# EAGLE design UV - SERVO_CTRL (EAGLE 6.3)
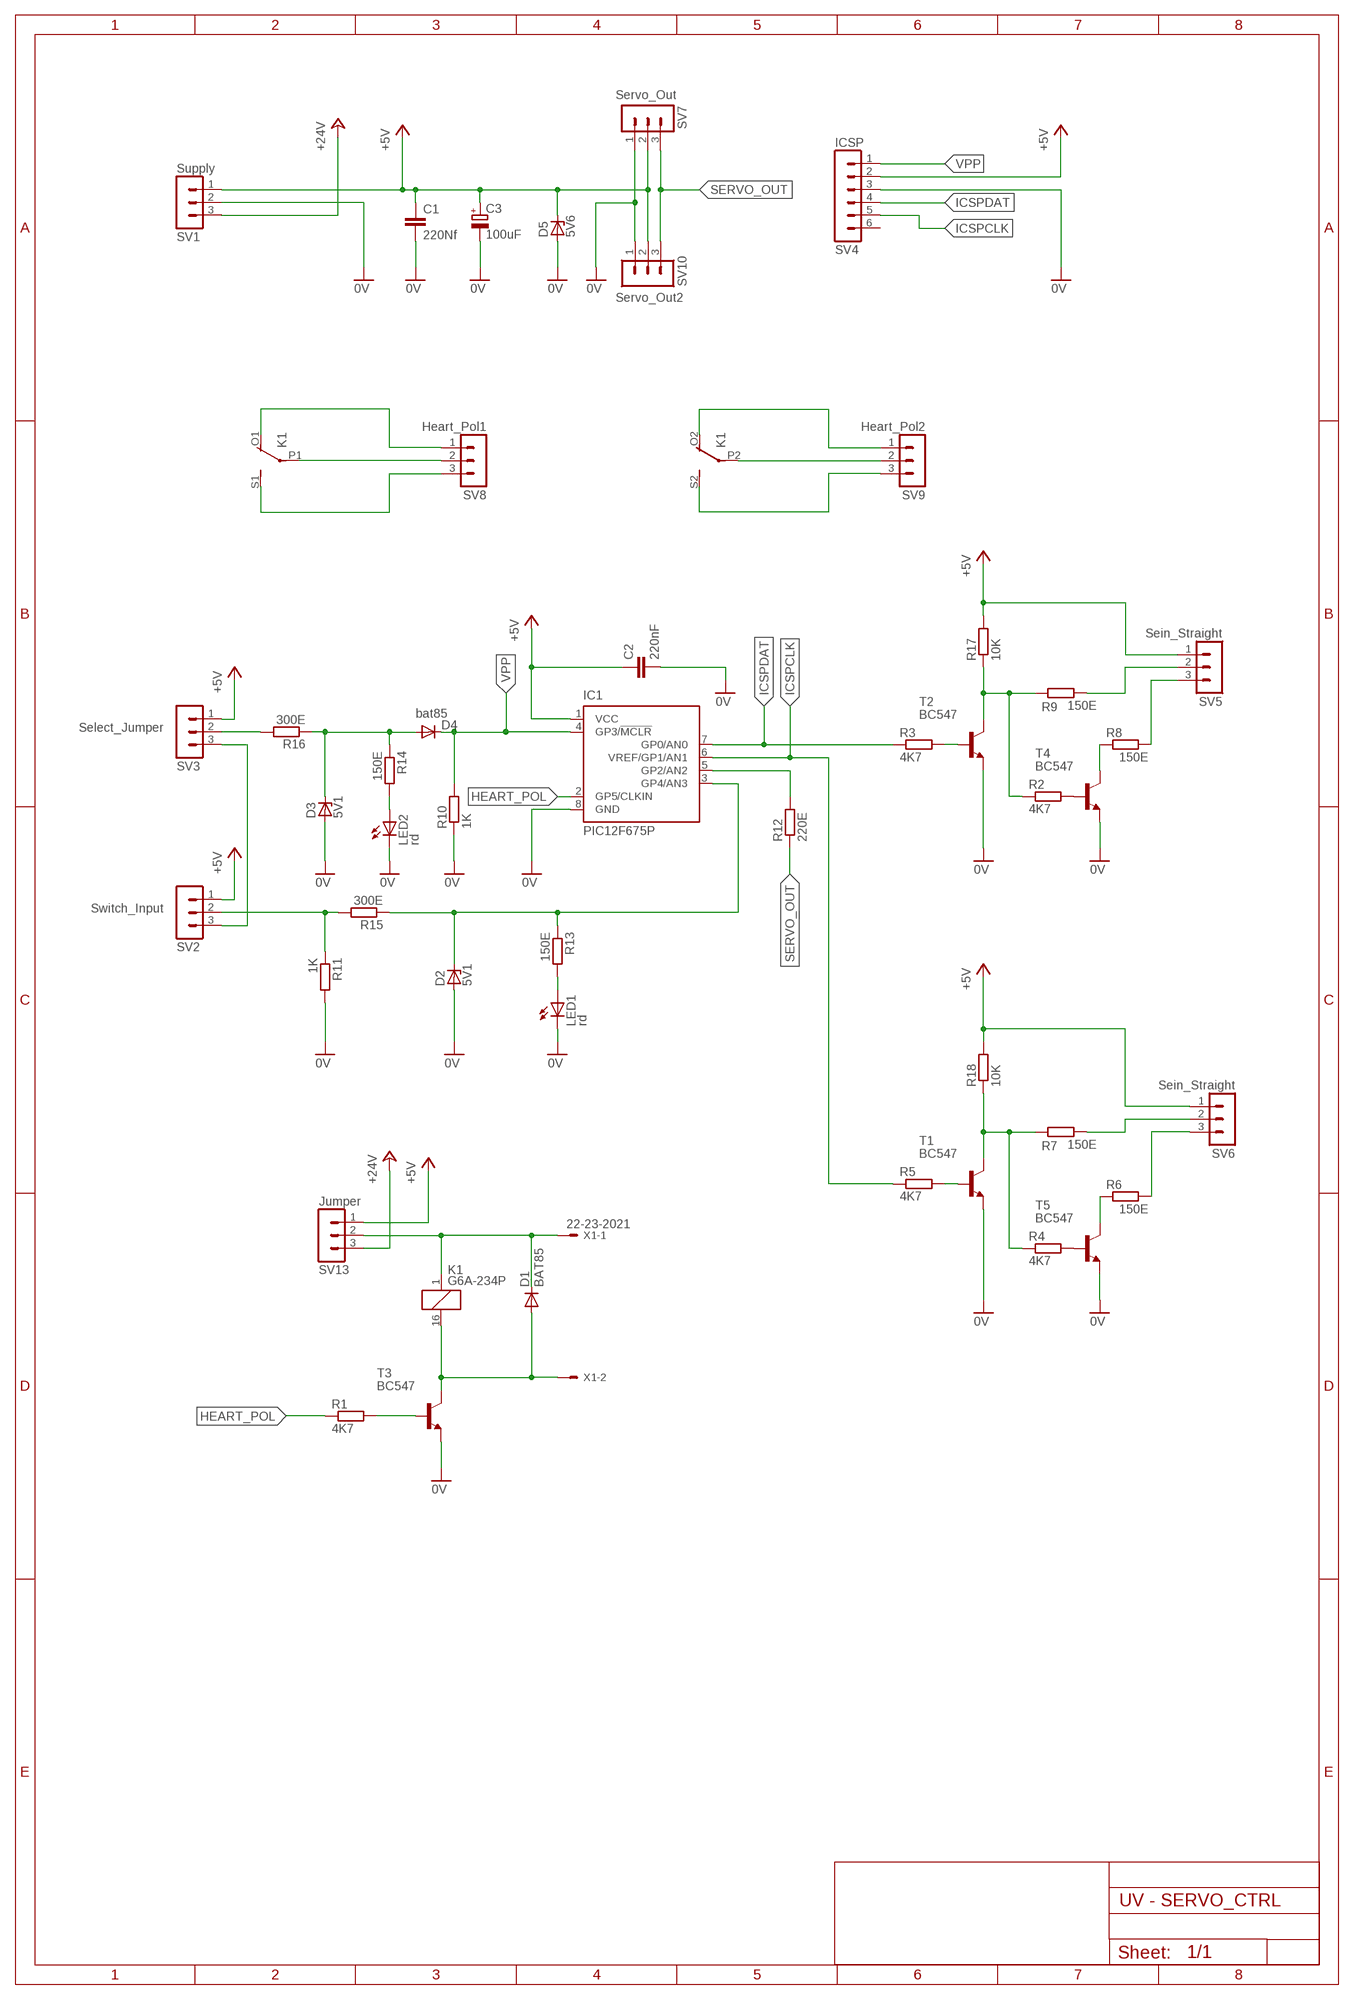
[diagram p0: schematic, sheet 1]

## Parts
C1  220Nf  C-EU050-025X075  [C050-025X075]
C2  220nF  C-EU050-025X075  [C050-025X075]
C3  100uF  CPOL-EUE2.5-7  [E2,5-7]
D1  BAT85  BAT81  [DO34-7]
D2  5V1  ZENER-DIODEDO34-7  [DO34Z7]
D3  5V1  ZENER-DIODEDO34-7  [DO34Z7]
D4  bat85  BAT81  [DO34-7]
D5  5V6  1N5333  [C1702-15]
IC1  PIC12F675P  [DIL8]
K1  G6A-234P  [G6A-234P]
LED1  rd  LED3MM  [LED3MM]
LED2  rd  LED3MM  [LED3MM]
R1  4K7  R-EU_0207/2V  [0207/2V]
R2  4K7  R-EU_0207/2V  [0207/2V]
R3  4K7  R-EU_0207/2V  [0207/2V]
R4  4K7  R-EU_0207/2V  [0207/2V]
R5  4K7  R-EU_0207/2V  [0207/2V]
R6  150E  R-EU_0207/2V  [0207/2V]
R7  150E  R-EU_0207/2V  [0207/2V]
R8  150E  R-EU_0207/2V  [0207/2V]
R9  150E  R-EU_0207/2V  [0207/2V]
R10  1K  R-EU_0207/2V  [0207/2V]
R11  1K  R-EU_0207/2V  [0207/2V]
R12  220E  R-EU_0207/2V  [0207/2V]
R13  150E  R-EU_0207/2V  [0207/2V]
R14  150E  R-EU_0207/2V  [0207/2V]
R15  300E  R-EU_0207/2V  [0207/2V]
R16  300E  R-EU_0207/2V  [0207/2V]
R17  10K  R-EU_0207/2V  [0207/2V]
R18  10K  R-EU_0207/2V  [0207/2V]
SV1  Supply  MA03-1  [MA03-1]
SV2  Switch_Input  MA03-1  [MA03-1]
SV3  Select_Jumper  MA03-1  [MA03-1]
SV4  ICSP  MA06-1  [MA06-1]
SV5  Sein_Straight  MA03-1  [MA03-1]
SV6  Sein_Straight  MA03-1  [MA03-1]
SV7  Servo_Out  MA03-1  [MA03-1]
SV8  Heart_Pol1  MA03-1  [MA03-1]
SV9  Heart_Pol2  MA03-1  [MA03-1]
SV10  Servo_Out2  MA03-1  [MA03-1]
SV13  Jumper  MA03-1  [MA03-1]
T1  BC547  [TO92]
T2  BC547  [TO92]
T3  BC547  [TO92]
T4  BC547  [TO92]
T5  BC547  [TO92]
X1  22-23-2021  [22-23-2021]

## Nets
0V: C1.2 C2.2 C3.- D2.A D3.A D5.A IC1.8(GND) LED1.K(C) LED2.K(C) R10.1 R11.2 SV1.2 SV4.3 SV7.1 SV10.1 T1.1(E) T2.1(E) T3.1(E) T4.1(E) T5.1(E)
+5V: C1.1 C2.1 C3.+ D5.C IC1.1(VCC) R17.2 R18.2 SV1.1 SV2.1 SV3.1 SV4.2 SV5.1 SV6.1 SV7.2 SV10.2 SV13.1
+24V: SV1.3 SV13.3
HEART_POL: IC1.2(GP5/CLKIN) R1.1
ICSPCLK: IC1.6(VREF/GP1/AN1) R5.1 SV4.5
ICSPDAT: IC1.7(GP0/AN0) R3.1 SV4.4
N$1: D2.C IC1.3(GP4/AN3) R13.1 R15.1
N$2: K1.O1(2:O) SV8.1
N$3: SV2.3 SV3.3
N$4: K1.S1(2:S) SV8.3
N$5: K1.P1(2:P) SV8.2
N$6: K1.O2(3:O) SV9.1
N$7: K1.S2(3:S) SV9.3
N$8: K1.P2(3:P) SV9.2
N$9: IC1.5(GP2/AN2) R12.2
N$10: R1.2 T3.2(B)
N$11: D1.C K1.1 SV13.2 X1.1
N$12: D1.A K1.16 T3.3(C) X1.2
N$13: R4.2 T5.2(B)
N$14: R6.1 T5.3(C)
N$15: R6.2 SV6.3
N$16: R5.2 T1.2(B)
N$17: R11.1 R15.2 SV2.2
N$18: R4.1 R7.1 R18.1 T1.3(C)
N$19: R7.2 SV6.2
N$20: R2.2 T4.2(B)
N$21: R8.1 T4.3(C)
N$22: R8.2 SV5.3
N$23: R9.2 SV5.2
N$24: R2.1 R9.1 R17.1 T2.3(C)
N$25: R3.2 T2.2(B)
N$26: D3.C D4.A R14.1 R16.1
N$27: LED2.A R14.2
N$28: LED1.A R13.2
N$29: R16.2 SV3.2
SERVO_OUT: R12.1 SV7.3 SV10.3
VPP: D4.C IC1.4(GP3/!MCLR) R10.2 SV4.1
Unconnected: SV4.6

## Library data of the parts
C1 C2 = rcl:C-EU: CAPACITOR, European symbol; MPN: MCPBSFC-1J222KA45; OC_NEWARK: 49P5385
C3 = rcl:CPOL-EU: POLARIZED CAPACITOR, European symbol; MF: ILLINOIS CAPACITOR,INC.; MPN: 107CKE035M; OC_NEWARK: 69K7903
D1 D4 = diode:BAT81: DIODE barrier diode; MPN: BAT85,113; OC_NEWARK: 75R0671
D2 D3 = diode:ZENER-DIODE: Z-Diode; MPN: BZX55C5V1-TAP; OC_NEWARK: 55R1524
D5 = diode:1N5333: Z DIODE 3.3 V, 5W, 5 percent (Motorola); MF: FAIRCHILD SEMICONDUCTOR; MPN: BZX85C5V1; OC_NEWARK: 18C6038
IC1 = microchip:PIC12F675: 8-Pin FLASH-Based 8-Bit CMOS Microcontroller Precision Internal 4 MHz oscillator factory calibrated to ±1% Low Power Features: Standby Current: - 1 nA @ 2.0V, typical Operating Current: - 8.5µA @ 32 kHz, 2.0V, typical - 100µA @ 1 MHz, 2.0V, typical Watchdog Timer Current: - 300 nA @ 2.0V, typical Timer1 oscillator current: - 4µA @ 32 kHz, 2.0V, typical Analog-to-Digital Converter module: - 10-bit resolution - Programmable 4-channel input - Voltage reference input Source: http://www.microchip.com .. 41190E.pdf; MF: MICROCHIP; MPN: PIC12F675-E/P; OC_FARNELL: 9759018; OC_NEWARK: 92C4340
K1 = relay:G6A-234P: RELAY 2 x switch, 0.3 A/125 V AC, 1 A/30 V DC, Omron; MF: OMRON COMPONENTS USA; MPN: G6A-234P-ST40-US-DC12; OC_FARNELL: unknown; OC_NEWARK: 89C6109
LED1 LED2 = led:LED: LED OSRAM: - CHIPLED LG R971, LG N971, LY N971, LG Q971, LY Q971, LO R971, LY R971 LH N974, LH R974 LS Q976, LO Q976, LY Q976 LO Q996 - Hyper CHIPLED LW Q18S LB Q993, LB Q99A, LB R99A - SideLED LS A670, LO A670, LY A670, LG A670, LP A670 LB A673, LV A673, LT A673, LW A673 LH A674 LY A675 LS A676, LA A676, LO A676, LY A676, LW A676 LS A679, LY A679, LG A679 - Hyper Micro SIDELED® LS Y876, LA Y876, LO Y876, LY Y876 LT Y87S - SmartLED LW L88C, LW L88S LB L89C, LB L89S, LG L890 LS L89K, LO L89K, LY L89K LS L896, LA L896, LO L896, LY L896 - TOPLED LS T670, LO T670, LY T670, LG T670, LP T670 LSG T670, LSP T670, LSY T670, LOP T670, LYG T670 LG T671, LOG T671, LSG T671 LB T673, LV T673, LT T673, LW T673 LH T674 LS T676, LA T676, LO T676, LY T676, LB T676, LH T676, LSB T676, LW T676 LB T67C, LV T67C, LT T67C, LS T67K, LO T67K, LY T67K, LW E67C LS E67B, LA E67B, LO E67B, LY E67B, LB E67C, LV E67C, LT E67C LW T67C LS T679, LY T679, LG T679 LS T770, LO T770, LY T770, LG T770, LP T770 LB T773, LV T773, LT T773, LW T773 LH T774 LS E675, LA E675, LY E675, LS T675 LS T776, LA T776, LO T776, LY T776, LB T776 LHGB T686 LT T68C, LB T68C - Hyper Mini TOPLED® LB M676 - Mini TOPLED Santana® LG M470 LS M47K, LO M47K, LY M47K Source: http://www.osram.convergy.de LUXEON: - LUMILED® LXK2-PW12-R00, LXK2-PW12-S00, LXK2-PW14-U00, LXK2-PW14-V00 LXK2-PM12-R00, LXK2-PM12-S00, LXK2-PM14-U00 LXK2-PE12-Q00, LXK2-PE12-R00, LXK2-PE12-S00, LXK2-PE14-T00, LXK2-PE14-U00 LXK2-PB12-K00, LXK2-PB12-L00, LXK2-PB12-M00, LXK2-PB14-N00, LXK2-PB14-P00, LXK2-PB14-Q00 LXK2-PR12-L00, LXK2-PR12-M00, LXK2-PR14-Q00, LXK2-PR14-R00 LXK2-PD12-Q00, LXK2-PD12-R00, LXK2-PD12-S00 LXK2-PH12-R00, LXK2-PH12-S00 LXK2-PL12-P00, LXK2-PL12-Q00, LXK2-PL12-R00 Source: www.luxeon.com KINGBRIGHT: KA-3528ASYC Source: www.kingbright.com; MPN: L-934ND; OC_NEWARK: 26M0081
R1-R5 = rcl:R-EU_: RESISTOR, European symbol; MF: FARNELL; MPN: MCF 0.25W 4K7; OC_NEWARK: 38K0376
R6-R9 R13 R14 = rcl:R-EU_: RESISTOR, European symbol; MF: FARNELL; MPN: MCF 0.25W 150R; OC_NEWARK: 38K0339
R10 R11 = rcl:R-EU_: RESISTOR, European symbol; MF: FARNELL; MPN: MCF 0.25W 1K; OC_NEWARK: 38K0327
R12 = rcl:R-EU_: RESISTOR, European symbol; MF: FARNELL; MPN: MCF 0.25W 220R; OC_NEWARK: 38K0351
R15 R16 = rcl:R-EU_: RESISTOR, European symbol; MF: FARNELL; MPN: MF25 300R; OC_NEWARK: 38K5327
R17 R18 = rcl:R-EU_: RESISTOR, European symbol; MF: FARNELL; MPN: MCF 0.25W 10K; OC_NEWARK: 38K0328
SV1-SV3 SV5-SV10 SV13 = con-lstb:MA03-1: PIN HEADER; MPN: 90120-0761; OC_FARNELL: unknown; OC_NEWARK: 34R6158
SV4 = con-lstb:MA06-1: PIN HEADER; MPN: 90120-0761; OC_FARNELL: unknown; OC_NEWARK: 34R6158
T1-T5 = transistor:BC547: NPN TRANSISTOR; MPN: BC547B; OC_NEWARK: 08N8056
X1 = con-molex:22-23-2021: .100" (2.54mm) Center Header - 2 Pin; MF: MOLEX; MPN: 22-23-2021; OC_FARNELL: 1462926; OC_NEWARK: 25C3832

## Board
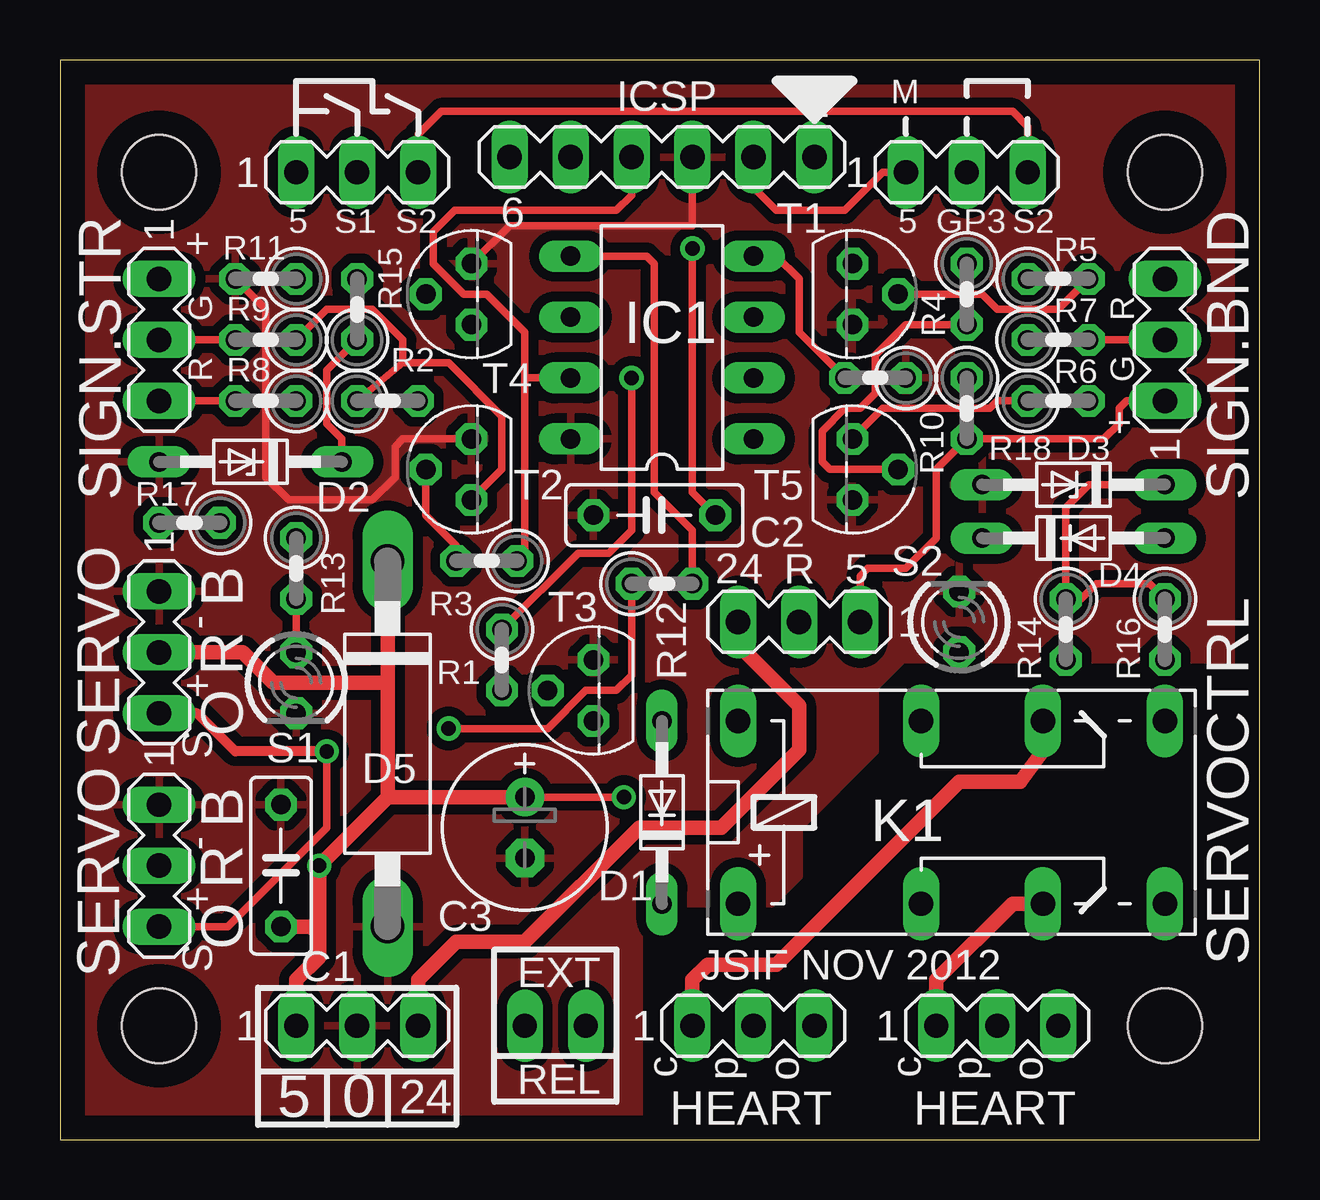
[diagram p1: board, top side]
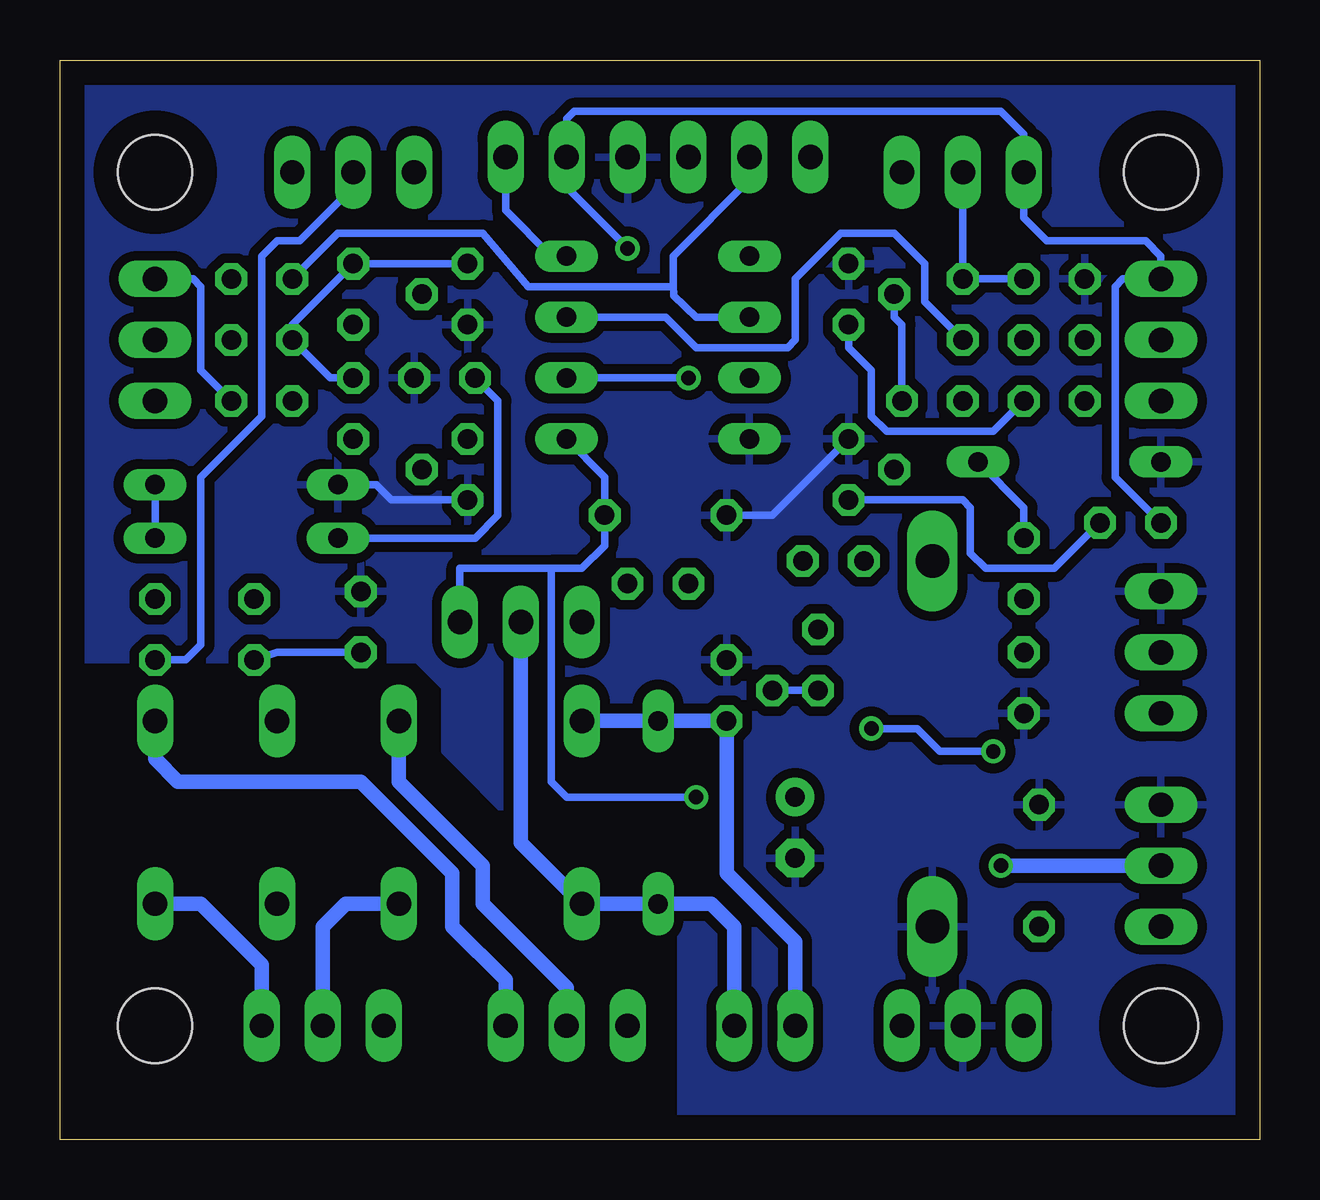
[diagram p2: board, bottom side, seen from below]

Size 50 x 45 mm. Coordinates in mm from the lower left corner, seen from the top.
Outline: 0,0 50,0 50,45 0,45 0,0
Copper layers (1*16): Top 0.035mm / dielectric 1.5mm / Bottom 0.035mm
Design rules "default *": minimum track width 10mil, minimum drill 20mil, track to track 8mil, track to pad 8mil, pad to pad 8mil, via to via 8mil, smd to smd 8mil, copper to edge 40mil, drill to drill 8mil, minimum pad ring 10mil, minimum via ring 8mil, stop-mask expansion 4mil, vias tented up to drill 0mil, thermal gap 16mil
Holes 3.1 mm at 4.13,4.76 46.04,4.76 4.13,40.32 46.04,40.32

### Footprints (pad centres in the part's own frame; a part is rotated, then mirrored left to right if it is on the bottom)
C050-025X075 = drill 0.813 octagon: 1 -2.54,0; 2 2.54,0
E2,5-7 = drill 0.813 pad 1.6: + -1.27,0 | drill 0.813 pad 1.6 octagon: - 1.27,0
DO34-7 = drill 0.813 long: A 3.81,0; C -3.81,0
DO34Z7 = drill 0.813 long: A 3.81,0; C -3.81,0
C1702-15 = drill 1.397 long: A 7.62,0; C -7.62,0
DIL8 = drill 0.813 long: 1 -3.81,-3.81; 2 -1.27,-3.81; 3 1.27,-3.81; 4 3.81,-3.81; 5 3.81,3.81; 6 1.27,3.81; 7 -1.27,3.81; 8 -3.81,3.81
G6A-234P = drill 1.016 long: 1 -3.81,-3.81; 16 -3.81,3.81; O1 8.89,-3.81; O2 8.89,3.81; P1 3.81,-3.81; P2 3.81,3.81; S1 13.97,-3.81; S2 13.97,3.81
LED3MM = drill 0.813 octagon: A -1.27,0; K 1.27,0
0207/2V = drill 0.813 octagon: 1 -1.27,0; 2 1.27,0
MA03-1 = drill 1.016 long: 1 -2.54,0; 2 0,0; 3 2.54,0
MA06-1 = drill 1.016 long: 1 -6.35,0; 2 -3.81,0; 3 -1.27,0; 4 1.27,0; 5 3.81,0; 6 6.35,0
TO92 = drill 0.813 octagon: 1 1.27,0; 2 0,1.905; 3 -1.27,0
22-23-2021 = drill 1 long: 1 -1.27,0; 2 1.27,0

### Placement (x,y rotation side)
C1  9.21,11.43 90 top
C2  24.77,26.04 180 top
C3  19.37,13.02 270 top
D1  25.08,13.65 90 top
D2  7.94,28.26 180 top
D3  42.23,27.3 180 top
D4  42.23,25.08 0 top
D5  13.65,16.51 270 top
IC1  25.08,33.02 90 top
K1  32.07,13.65 0 top
LED1  9.84,19.05 270 top
LED2  37.47,21.59 90 top
R1  18.41,20 270 top
R2  13.65,30.8 0 top
R3  17.78,24.13 180 top
R4  37.78,35.24 270 top
R5  41.59,35.88 0 top
R6  41.59,30.8 0 top
R7  41.59,33.34 0 top
R8  8.57,30.8 180 top
R9  8.57,33.34 180 top
R10  33.97,31.75 180 top
R11  8.57,35.88 180 top
R12  25.08,23.18 0 top
R13  9.84,23.81 270 top
R14  41.91,21.27 270 top
R15  12.38,34.61 90 top
R16  46.04,21.27 270 top
R17  5.4,25.72 180 top
R18  37.78,30.48 270 top
SV1  12.38,4.76 0 top
SV2  12.38,40.32 0 top
SV3  37.78,40.32 0 top
SV4  25.08,40.96 180 top
SV5  4.13,33.34 270 top
SV6  46.04,33.34 90 top
SV7  4.13,11.43 270 top
SV8  39.05,4.76 0 top
SV9  28.89,4.76 0 top
SV10  4.13,20.32 270 top
SV13  30.8,21.59 180 top
T1  33.02,35.24 270 top
T2  17.14,27.94 90 top
T3  22.23,18.73 90 top
T4  17.14,35.24 90 top
T5  33.02,27.94 270 top
X1  20.64,4.76 180 top

### Tracks (layer width: path | path; a pad name or v marks a point on that pad's centre or on a via)
0V
  Top 0.305: SV4.3 26.35,38.1 18.73,38.1 T4.1 | R11.2 8.57,34.61 8.57,27.62 9.53,26.67 13.02,26.67 13.97,27.62 13.97,28.89 14.29,29.21 T2.1
  Bottom 0.305: T5.1 36.2,26.67 36.83,27.3 D3.A | T1.1 33.34,33.97 | T2.1 20.32,26.04 C2.2
  pour Bottom (isolate 0.406): 0.32,0.32 0.32,44.77 49.85,44.77 49.85,20 35.12,20 33.97,18.86 33.97,16.19 30.8,13.02 30.8,10.85 29.79,9.84 24.13,9.84 24.13,0.32
  pour Top (isolate 0.406): 0.32,0.32 0.32,44.77 49.85,44.77 49.85,20 35.12,20 33.97,18.86 33.97,16.19 30.8,13.02 30.8,10.99 29.65,9.84 24.13,9.84 24.13,0.32
+5V  (via drill 0.6)
  Top 0.305: v23.5,14.29 C3.+ | v26.35,37.15 26.35,26.99 C2.1 | SV13.1 33.34,23.5 33.66,23.81 35.24,23.81 36.51,25.08 36.51,27.94 R18.2 43.5,29.21 44.13,29.84 44.13,30.48 44.45,30.8 SV6.1 | SV3.1 34.29,40.32 32.7,38.73 29.84,38.73 28.89,39.69 SV4.2
  Top 0.61: D5.C 13.65,19.05 | 13.65,19.05 13.65,14.29 | 13.65,14.29 C3.+ | SV1.1 9.84,6.67 10.79,7.62 10.79,8.57 | 13.65,14.29 v10.79,11.43 10.79,8.57 | C1.1 10.48,8.89 10.79,8.57 | SV10.2 7.62,20.32 8.89,19.05 13.65,19.05
  Bottom 0.305: IC1.1 27.3,27.62 C2.1 27.3,24.77 28.26,23.81 29.53,23.81 | 29.53,23.81 29.53,14.92 28.89,14.29 v23.5,14.29 | SV13.1 33.34,23.81 29.53,23.81 | v26.35,37.15 28.89,39.69 SV4.2 28.89,42.55 28.57,42.86 10.79,42.86 9.84,41.91 SV2.1 9.84,38.42 8.89,37.47 4.76,37.47 4.13,36.83 SV5.1 5.71,35.88 6.03,35.56 6.03,27.62 R17.2
  Bottom 0.61: v10.79,11.43 SV7.2
+24V
  Top 0.61: SV1.3 14.92,6.67 15.56,7.3 16.51,8.26 19.37,8.26 24.13,13.02 27.55,13.02 30.8,16.26 30.8,18.1 28.26,20.64 SV13.3
HEART_POL  (via drill 0.6)
  Top 0.305: R1.1 21.59,24.45 22.86,24.45 23.81,25.4 v23.81,31.75
  Bottom 0.305: v23.81,31.75 IC1.2
ICSPCLK
  Bottom 0.305: R5.1 38.42,37.78 32.38,37.78 30.48,35.56 24.45,35.56 24.45,35.63 | 24.45,35.63 24.42,35.17 23.49,34.29 IC1.6 | SV4.5 21.27,40.01 24.45,36.83 24.45,35.63
ICSPDAT
  Top 0.305: SV4.4 23.81,39.37 23.18,38.73 16.46,38.73 15.56,37.84 15.56,36.51 16.83,35.24 17.78,35.24 19.37,33.66 19.37,31.75 | 19.37,31.75 19.37,24.45 R3.1 | IC1.7 19.37,31.75
N$1
  Top 0.305: D2.C 11.75,29.21 11.11,29.84 11.11,32.07 R15.1
  Bottom 0.305: IC1.3 24.77,34.29 23.5,33.02 19.68,33.02 19.37,33.34 19.37,35.88 17.46,37.78 15.24,37.78 13.97,36.51 13.97,34.92 R15.1 | R13.1 9.84,26.35 D2.C
N$2
  Top 0.61: SV8.1 36.51,6.67 39.69,9.84 K1.O1
N$3
  Top 0.305: SV2.3 14.92,41.91 15.88,42.86 39.69,42.86 40.32,42.23 SV3.3
N$4
  Bottom 0.61: K1.S1 44.13,9.84 41.59,7.3 SV8.3
N$5
  Bottom 0.61: K1.P1 38.1,9.84 39.05,8.89 SV8.2
N$6
  Top 0.61: SV9.1 26.35,6.67 26.99,7.3 29.84,7.3 37.47,14.92 40.01,14.92 40.96,16.19 K1.O2
N$7
  Bottom 0.61: SV9.3 31.43,6.67 33.66,8.89 33.66,11.11 37.47,14.92 45.09,14.92 46.04,15.88 K1.S2
N$8
  Bottom 0.61: SV9.2 28.89,6.35 32.38,9.84 32.38,11.43 35.88,14.92 K1.P2
N$9
  Top 0.305: R12.2 26.35,25.4 24.77,26.99 24.77,36.51 24.45,36.83 IC1.5
N$10
  Bottom 0.305: T3.2 R1.2
N$11
  Bottom 0.61: X1.1 21.91,8.89 22.86,9.84 D1.C K1.1 30.8,12.38 SV13.2
N$12
  Bottom 0.61: X1.2 19.37,8.26 22.23,11.11 T3.3 D1.A K1.16
N$13
  Top 0.305: T5.2 32.07,27.94 31.75,28.26 31.75,29.53 32.7,30.48 33.34,30.48 33.97,31.11 33.97,32.7 35.24,33.97 R4.2
N$14
  Top 0.305: R6.1 39.05,30.8 38.73,30.48 34.29,30.48 T5.3
N$15
  Bottom 0.305: R6.2 44.13,32.07 44.13,35.56 44.45,35.88 SV6.3
N$16
  Top 0.305: T1.2 38.42,35.24 39.05,34.61 41.59,34.61 R5.2
N$17
  Bottom 0.305: SV2.2 R15.2 R11.1
N$18
  Bottom 0.305: R18.1 38.73,31.75 R7.1 40.32,33.97 R4.1 T1.3
N$19
  Top 0.305: SV6.2 R7.2
N$20
  Bottom 0.305: R2.2 14.92,33.97 15.24,34.29 T4.2
N$21
  Bottom 0.305: T4.3 17.14,33.02 16.19,32.07 16.19,30.16 15.56,29.53 11.11,29.53 R8.1
N$22
  Top 0.305: R8.2 SV5.3
N$23
  Top 0.305: R9.2 SV5.2
N$24
  Top 0.305: T2.3 18.41,27.94 18.41,30.16 16.19,32.38 14.29,32.38 | 14.29,32.38 14.29,33.34 13.02,34.61 11.11,34.61 R9.1 | R2.1 14.29,32.38
  Bottom 0.305: T2.3 12.38,26.67 12.06,26.35 12.06,24.45 11.43,23.81 8.57,23.81 R17.1
N$25
  Top 0.305: R3.2 16.51,24.77 15.24,26.04 T2.2
N$26
  Top 0.305: D3.C 42.86,27.3 41.91,26.35 R14.1 42.55,22.54 43.18,23.18 45.4,23.18 R16.1
  Bottom 0.305: D3.C D4.A
N$27
  Bottom 0.305: R14.2 40.96,20.32 LED2.A
N$28
  Top 0.305: LED1.A R13.2
N$29
  Bottom 0.305: SV3.2 37.78,39.69 40.01,37.47 40.96,37.47 41.59,36.83 41.59,30.16 44.13,27.62 44.13,20.64 44.77,20 R16.2
SERVO_OUT  (via drill 0.6)
  Top 0.305: SV7.3 6.99,8.89 11.11,13.02 v11.11,16.19 | v16.19,17.14 20.32,17.14 21.91,18.73 23.18,18.73 23.81,19.37 R12.1
  Top 0.406: v11.11,16.19 7.3,16.19 5.71,17.78 SV10.3
  Bottom 0.305: v11.11,16.19 13.34,16.19 14.29,17.14 v16.19,17.14
VPP
  Top 0.305: R10.2 30.8,33.66 30.8,35.88 29.84,36.83 IC1.4
  Bottom 0.305: D4.C 32.7,25.08 31.75,26.04 31.75,30.8 R10.2 | IC1.4 29.53,36.83 31.43,38.73 SV4.1

### Text on the board
tNames: ICSP | M | 5 | S1 | S2 | 5 | GP3 | S2 | + | G | R | R | G | + | SIGN.STR | SIGN.BND | SERVO | S2 | 24 | R | 5 | B | - | R | + | O | S1 | SERVO | S | B | - | + | R | O | S | JSIF NOV 2012 | SERVOCTRL | EXT | c | p | o | c | p | o | REL | 5 | 0 | 24 | HEART | HEART